# EasyEDA schematic 1-Schematic_BluePill.json
TITLE: BluePill; REV: 1.0; Date: 2020-12-18; Sheet: 1/1; Drawn By: spadger; Company: ECHO Studio
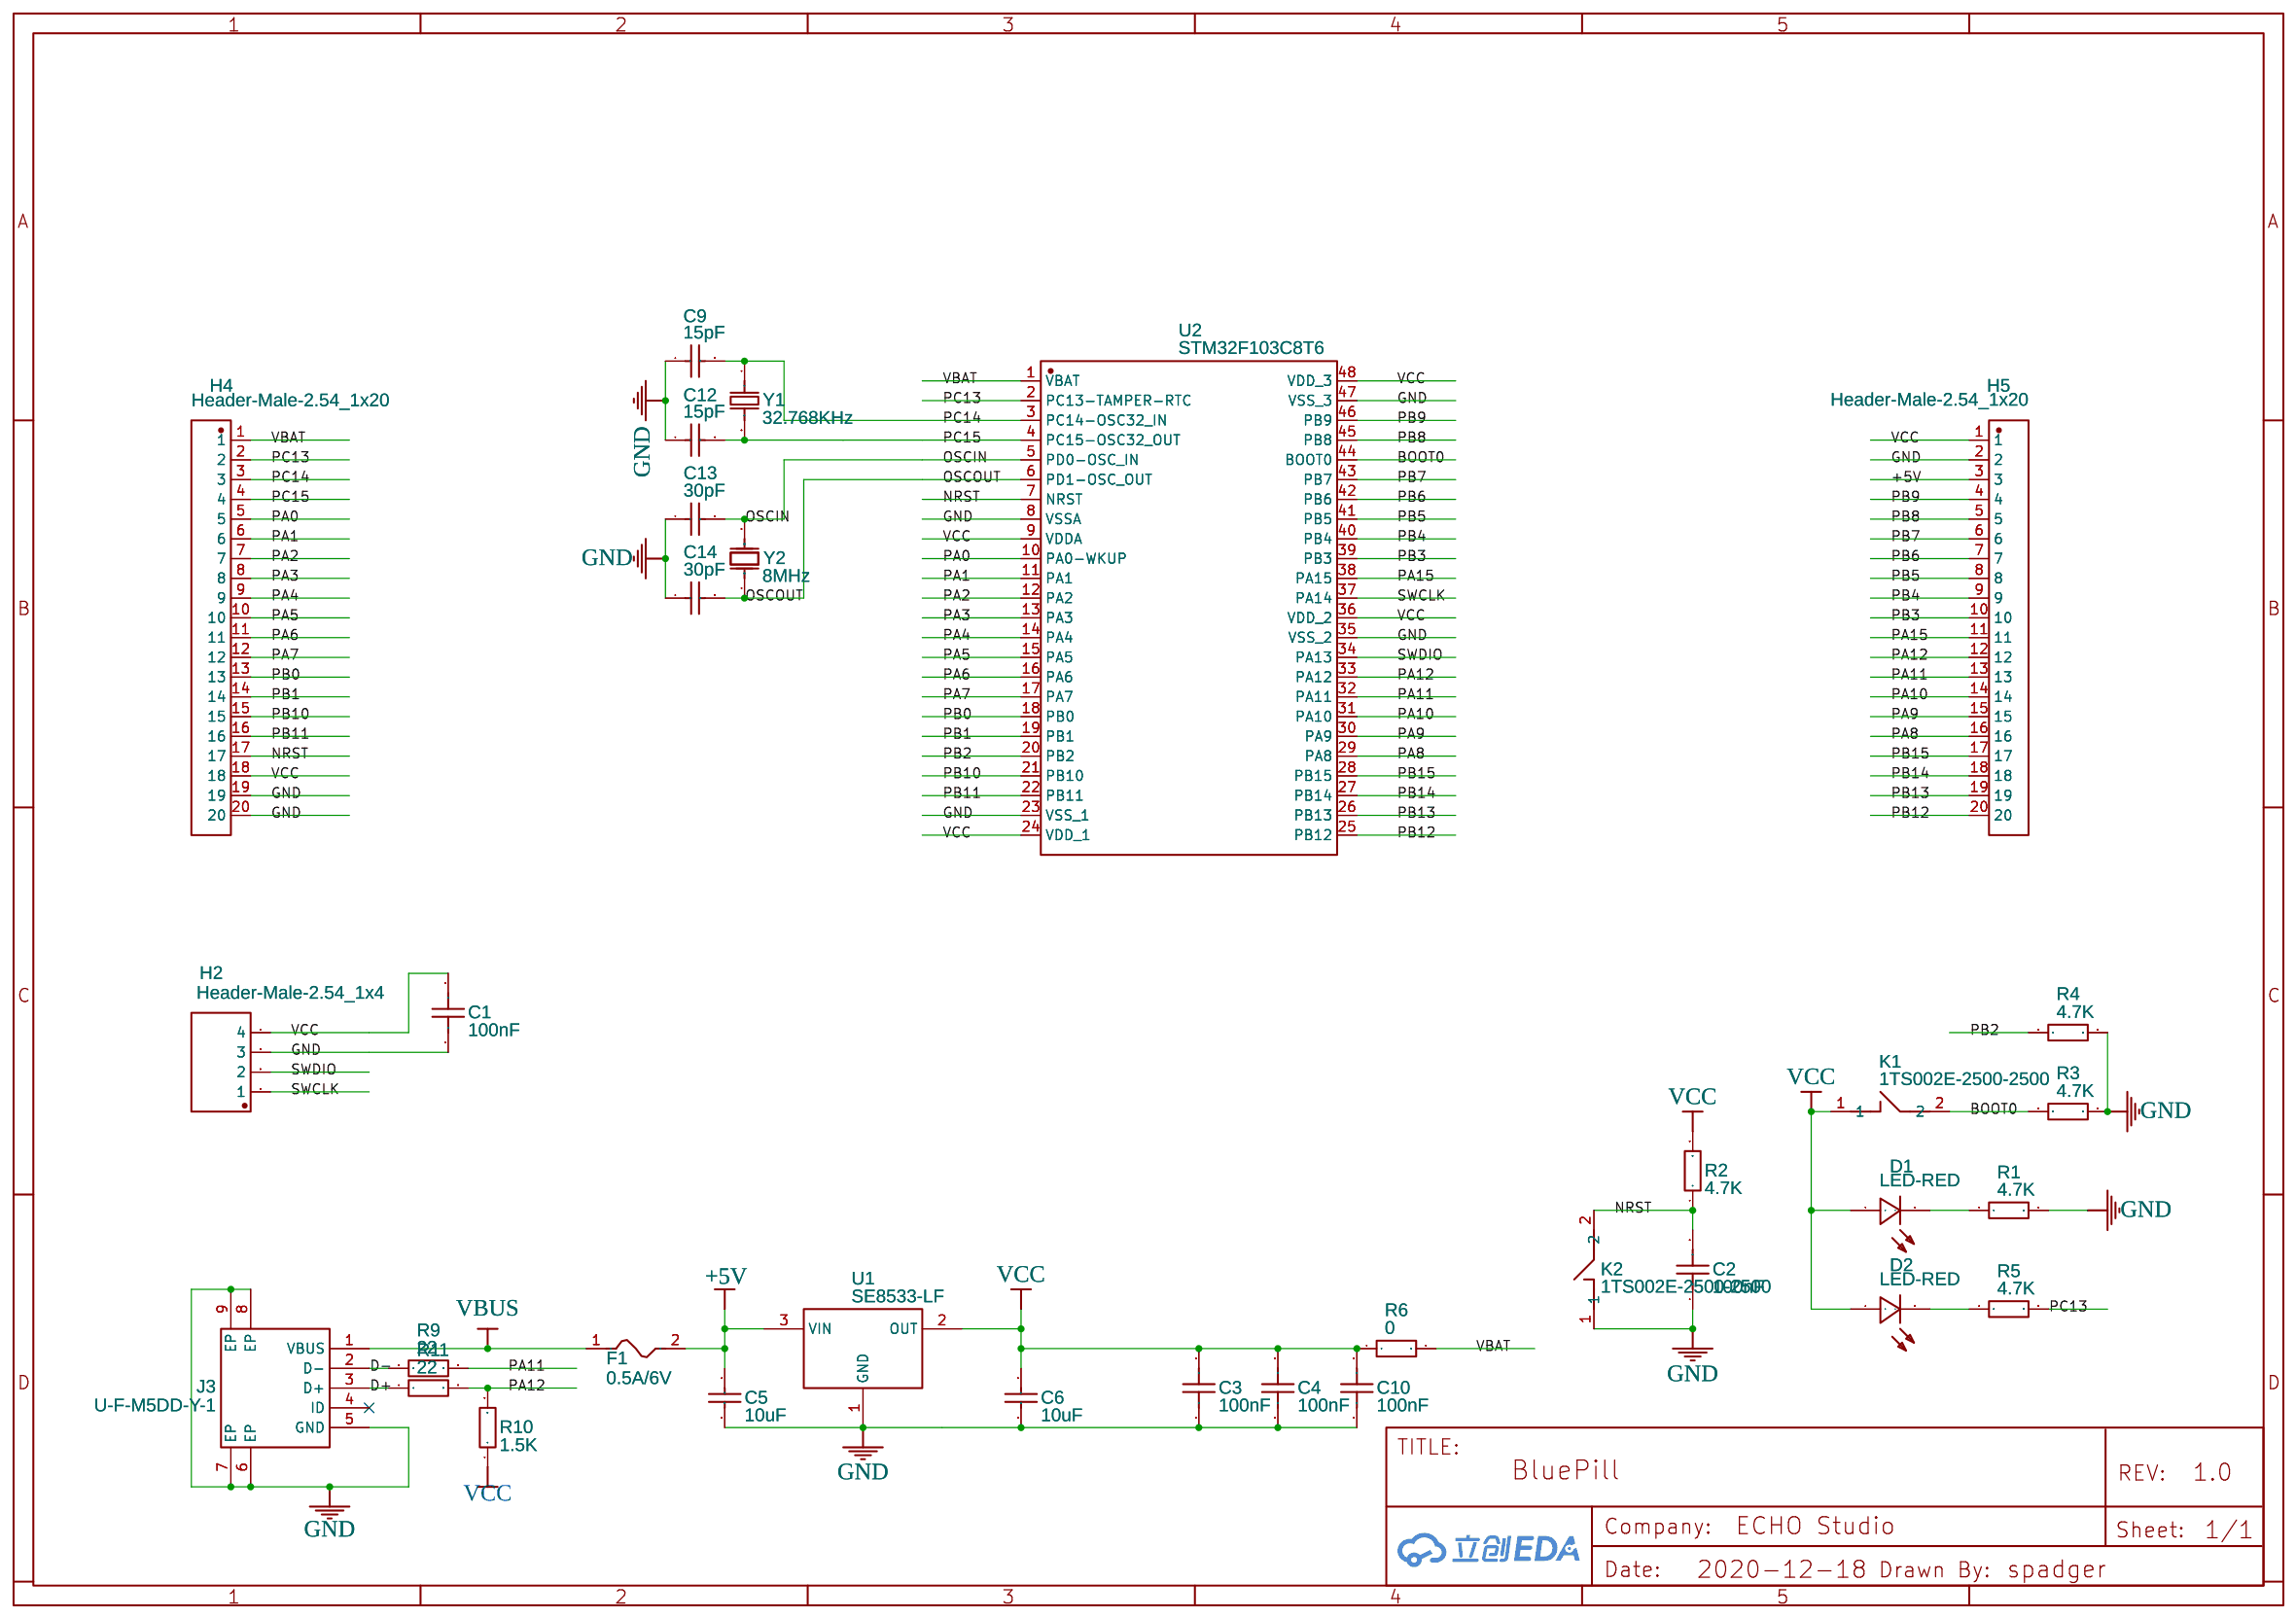
[diagram p0: schematic sheet]

## Parts
C1  100nF  [C0603]
C2  100nF  [C0603]
C3  100nF  [C0603]
C4  100nF  [C0603]
C5  10uF  [C0805]
C6  10uF  [C0805]
C9  15pF  [C0603]
C10  100nF  [C0603]
C12  15pF  [C0603]
C13  30pF  [C0603]
C14  30pF  [C0603]
D1  LED-RED  [LED-SMD_0805-R-RD]
D2  LED-RED  [LED-SMD_0805-R-RD]
F1  0.5A/6V  [0805]
H2  Header-Male-2.54_1x4  [HDR-TH_4P-P2.54-V]
H4  Header-Male-2.54_1x20  [HDR-TH_20P-P2.54-V]
H5  Header-Male-2.54_1x20  [HDR-TH_20P-P2.54-V]
J3  U-F-M5DD-Y-1  [U-F-M5DD-Y-1]
K1  1TS002E-2500-2500  [KEY_TOUCH_SMD_6.1*3.7*H]
K2  1TS002E-2500-2500  [KEY_TOUCH_SMD_6.1*3.7*H]
R1  4.7K  [R0603]
R2  4.7K  [R0603]
R3  4.7K  [R0603]
R4  4.7K  [R0603]
R5  4.7K  [R0603]
R6  0  [R0603]
R9  22  [R0603]
R10  1.5K  [R0603]
R11  22  [R0603]
U1  SE8533-LF  [SOT-23-3_L2.9-W1.3-P1.90-LS2.4-BR]
U2  STM32F103C8T6  [LQFP-48_L7.0-W7.0-P0.50-LS9.0-BL]
Y1  32.768KHz  [OSC-TH_BD3.0-P1.10-D0.4]
Y2  8MHz  [HC-49US_L11.5-W4.5-P4.88]

## Library data of the parts
C1-C4 C10 = CC0603KRX7R9BB104: Supplier: LCSC; Manufacturer: YAGEO; Supplier Part: C14663; SMT Type: Basic; JLCPCB SMD: Yes
C5 C6 = CL21A106KAYNNNE: Supplier: LCSC; Manufacturer: SAMSUNG; Supplier Part: C15850; SMT Type: Basic; JLCPCB SMD: Yes
C9 C12 = CL10C150JB8NNNC: Supplier: LCSC; Manufacturer: SAMSUNG; Supplier Part: C1644; SMT Type: Basic; JLCPCB SMD: Yes
C13 C14 = CL10C300JB8NNNC: Supplier: LCSC; Manufacturer: SAMSUNG; Supplier Part: C22397; SMT Type: Basic; JLCPCB SMD: Yes
D1 D2 = -: Supplier: LCSC; Manufacturer: Foshan NationStar Optoelectronics; Manufacturer Part: FC-DA1608UGK-520D10; Contributor: EasyEDA; Supplier Part: C84267
F1 = -: Supplier: LCSC; Manufacturer: Yenji; Manufacturer Part: SMD0805P050TF; Contributor: LCSC; Supplier Part: C130286
H2 = Header-Male-2.54_1x4: Supplier: LCSC; Manufacturer: Ckmtw; Manufacturer Part: 210S-1*4P L=11.6MMGold-plated black; Contributor: LCSC; Supplier Part: C124378
H4 H5 = Header-Male-2.54_1x20: Supplier: LCSC; Manufacturer: BOOMELE; Manufacturer Part: 2.54mm 1*20PHeader; image: //image.lceda.cn/szlcsc/C50981.jpg; Supplier Part: C50981
J3 = U-F-M5DD-Y-1: Supplier: LCSC; Manufacturer: HRO; Supplier Part: C91467
K1 K2 = 1TS002E-2500-2500: Supplier: LCSC; Supplier Part: C329185; Manufacturer: HYP; Contributor: LCSC
R1-R5 = 0603WAF4701T5E: Supplier: LCSC; Manufacturer: UniOhm; Supplier Part: C23162; SMT Type: Basic; JLCPCB SMD: Yes
R6 = 0603WAF0000T5E: Supplier: LCSC; Manufacturer: UniOhm; Supplier Part: C21189; SMT Type: Basic; JLCPCB SMD: Yes
R9 R11 = 0603WAF220JT5E: Supplier: LCSC; Manufacturer: UniOhm; Supplier Part: C23345; SMT Type: Basic; JLCPCB SMD: Yes
R10 = 0603WAF1501T5E: Supplier: LCSC; Manufacturer: UniOhm; Supplier Part: C22843; SMT Type: Basic; JLCPCB SMD: Yes
U1 = SE8533-LF: Supplier: LCSC; Manufacturer: SEAWARD; Supplier Part: C115016; SMT Type: Extend; JLCPCB SMD: Yes
U2 = STM32F103C8T6: Supplier: LCSC; Manufacturer: STMicroelectronics; image: //image.lceda.cn/szlcsc/C8734.jpg; Supplier Part: C8734; SMT Type: Basic; JLCPCB SMD: Yes
Y1 = DT-38 32.768KHz: Supplier: LCSC; Manufacturer: KDS; Supplier Part: C93228
Y2 = HC-49S 8MHz 20pF 30PPM: Supplier: LCSC; Supplier Part: C107425; Manufacturer: Zhejiang Abel Elec; Contributor: LCSC

## Nets
+5V: C5.2 F1.2 H5.3 U1.3(VIN)
GND: C1.1 C2.1 C3.1 C4.1 C5.1 C6.1 C9.1 C10.1 C12.1 C13.1 C14.1 H2.3 H4.19 H4.20 H5.2 J3.5(GND) J3.6(EP) J3.7(EP) J3.8(EP) J3.9(EP) K2.1 R1.2 R3.1 R4.2 U1.1(GND) U2.8(VSSA) U2.23(VSS_1) U2.35(VSS_2) U2.47(VSS_3)
VBAT: H4.1 R6.2 U2.1(VBAT)
VBUS: F1.1 J3.1(VBUS)
VCC: C1.2 C3.2 C4.2 C6.2 C10.2 D1.1(+) D2.1(+) H2.4 H4.18 H5.1 K1.1 R2.2 R6.1 R10.1 U1.2(OUT) U2.9(VDDA) U2.24(VDD_1) U2.36(VDD_2) U2.48(VDD_3)
BOOT0: K1.2 R3.2 U2.44(BOOT0)
D+: J3.3(D+) R11.1
D-: J3.2(D-) R9.1
NRST: C2.2 H4.17 K2.2 R2.1 U2.7(NRST)
OSCIN: C13.2 U2.5(PD0-OSC_IN) Y2.2(OSC2)
OSCOUT: C14.2 U2.6(PD1-OSC_OUT) Y2.1(OSC1)
PA0: H4.5 U2.10(PA0-WKUP)
PA1: H4.6 U2.11(PA1)
PA2: H4.7 U2.12(PA2)
PA3: H4.8 U2.13(PA3)
PA4: H4.9 U2.14(PA4)
PA5: H4.10 U2.15(PA5)
PA6: H4.11 U2.16(PA6)
PA7: H4.12 U2.17(PA7)
PA8: H5.16 U2.29(PA8)
PA9: H5.15 U2.30(PA9)
PA10: H5.14 U2.31(PA10)
PA11: H5.13 R9.2 U2.32(PA11)
PA12: H5.12 R10.2 R11.2 U2.33(PA12)
PA15: H5.11 U2.38(PA15)
PB0: H4.13 U2.18(PB0)
PB1: H4.14 U2.19(PB1)
PB2: R4.1 U2.20(PB2)
PB3: H5.10 U2.39(PB3)
PB4: H5.9 U2.40(PB4)
PB5: H5.8 U2.41(PB5)
PB6: H5.7 U2.42(PB6)
PB7: H5.6 U2.43(PB7)
PB8: H5.5 U2.45(PB8)
PB9: H5.4 U2.46(PB9)
PB10: H4.15 U2.21(PB10)
PB11: H4.16 U2.22(PB11)
PB12: H5.20 U2.25(PB12)
PB13: H5.19 U2.26(PB13)
PB14: H5.18 U2.27(PB14)
PB15: H5.17 U2.28(PB15)
PC13: H4.2 R5.2 U2.2(PC13-TAMPER-RTC)
PC14: C9.2 H4.3 U2.3(PC14-OSC32_IN) Y1.1
PC15: C12.2 H4.4 U2.4(PC15-OSC32_OUT) Y1.2
SWCLK: H2.1 U2.37(PA14)
SWDIO: H2.2 U2.34(PA13)
Net-(D1-2): D1.2(-) R1.1
Net-(D2-2): D2.2(-) R5.1

Not connected (* = marked no-connect by the designer): J3 4(ID)*
